# EAGLE board light_controller (EAGLE 9.2.2), part 1 of 2
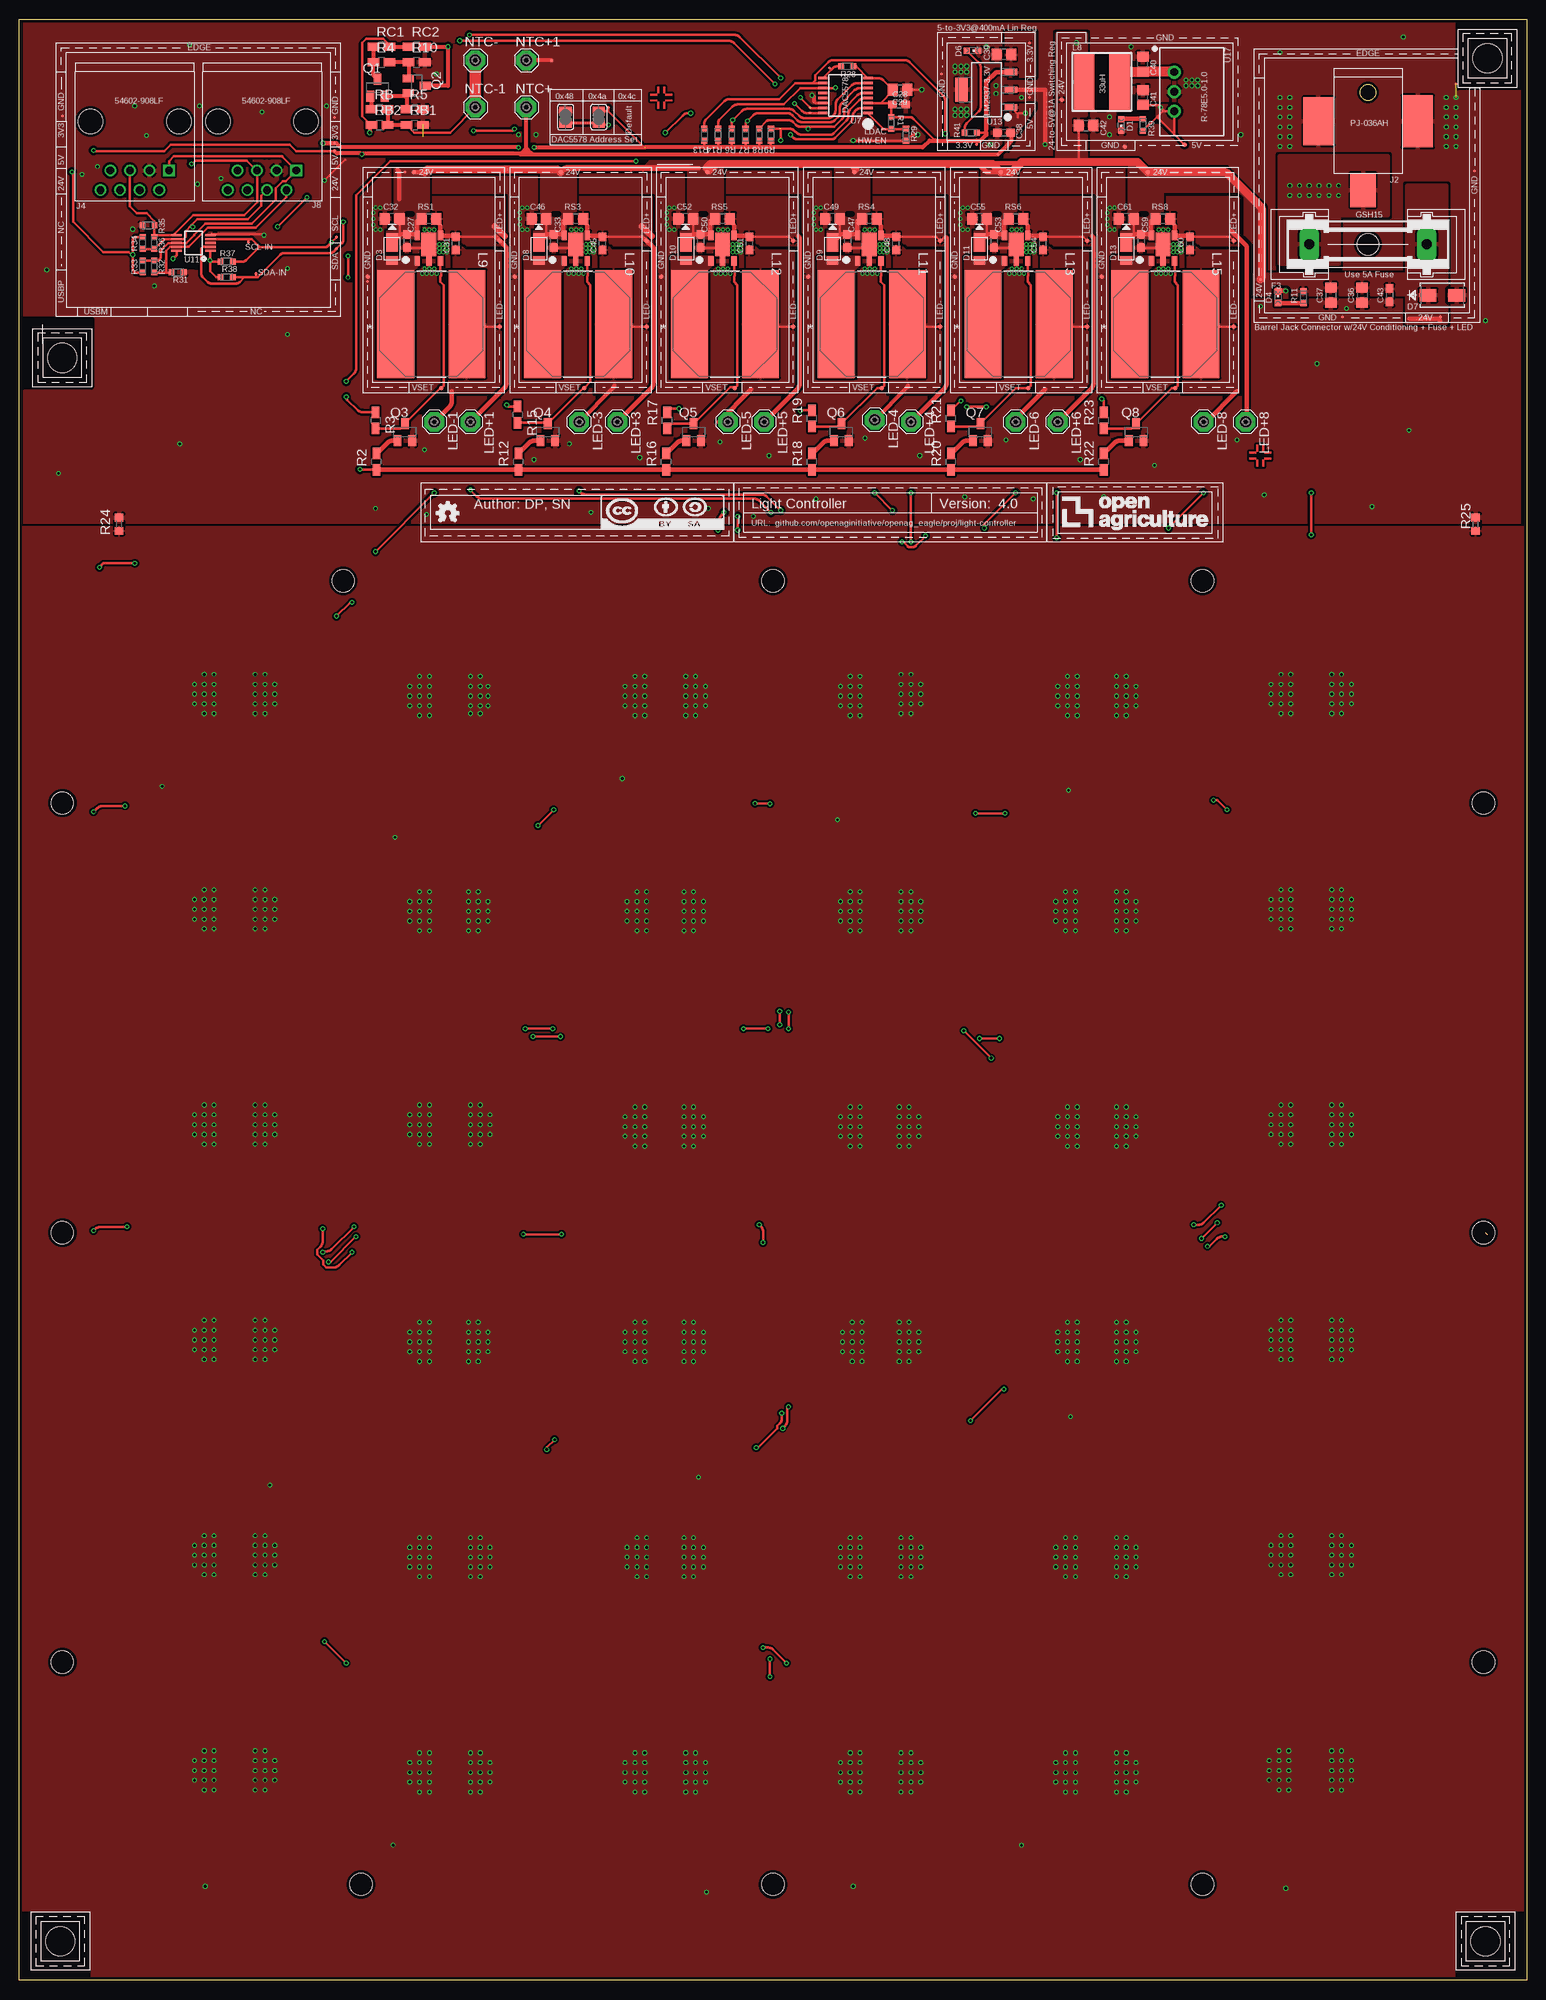
[diagram p2: board, top side]
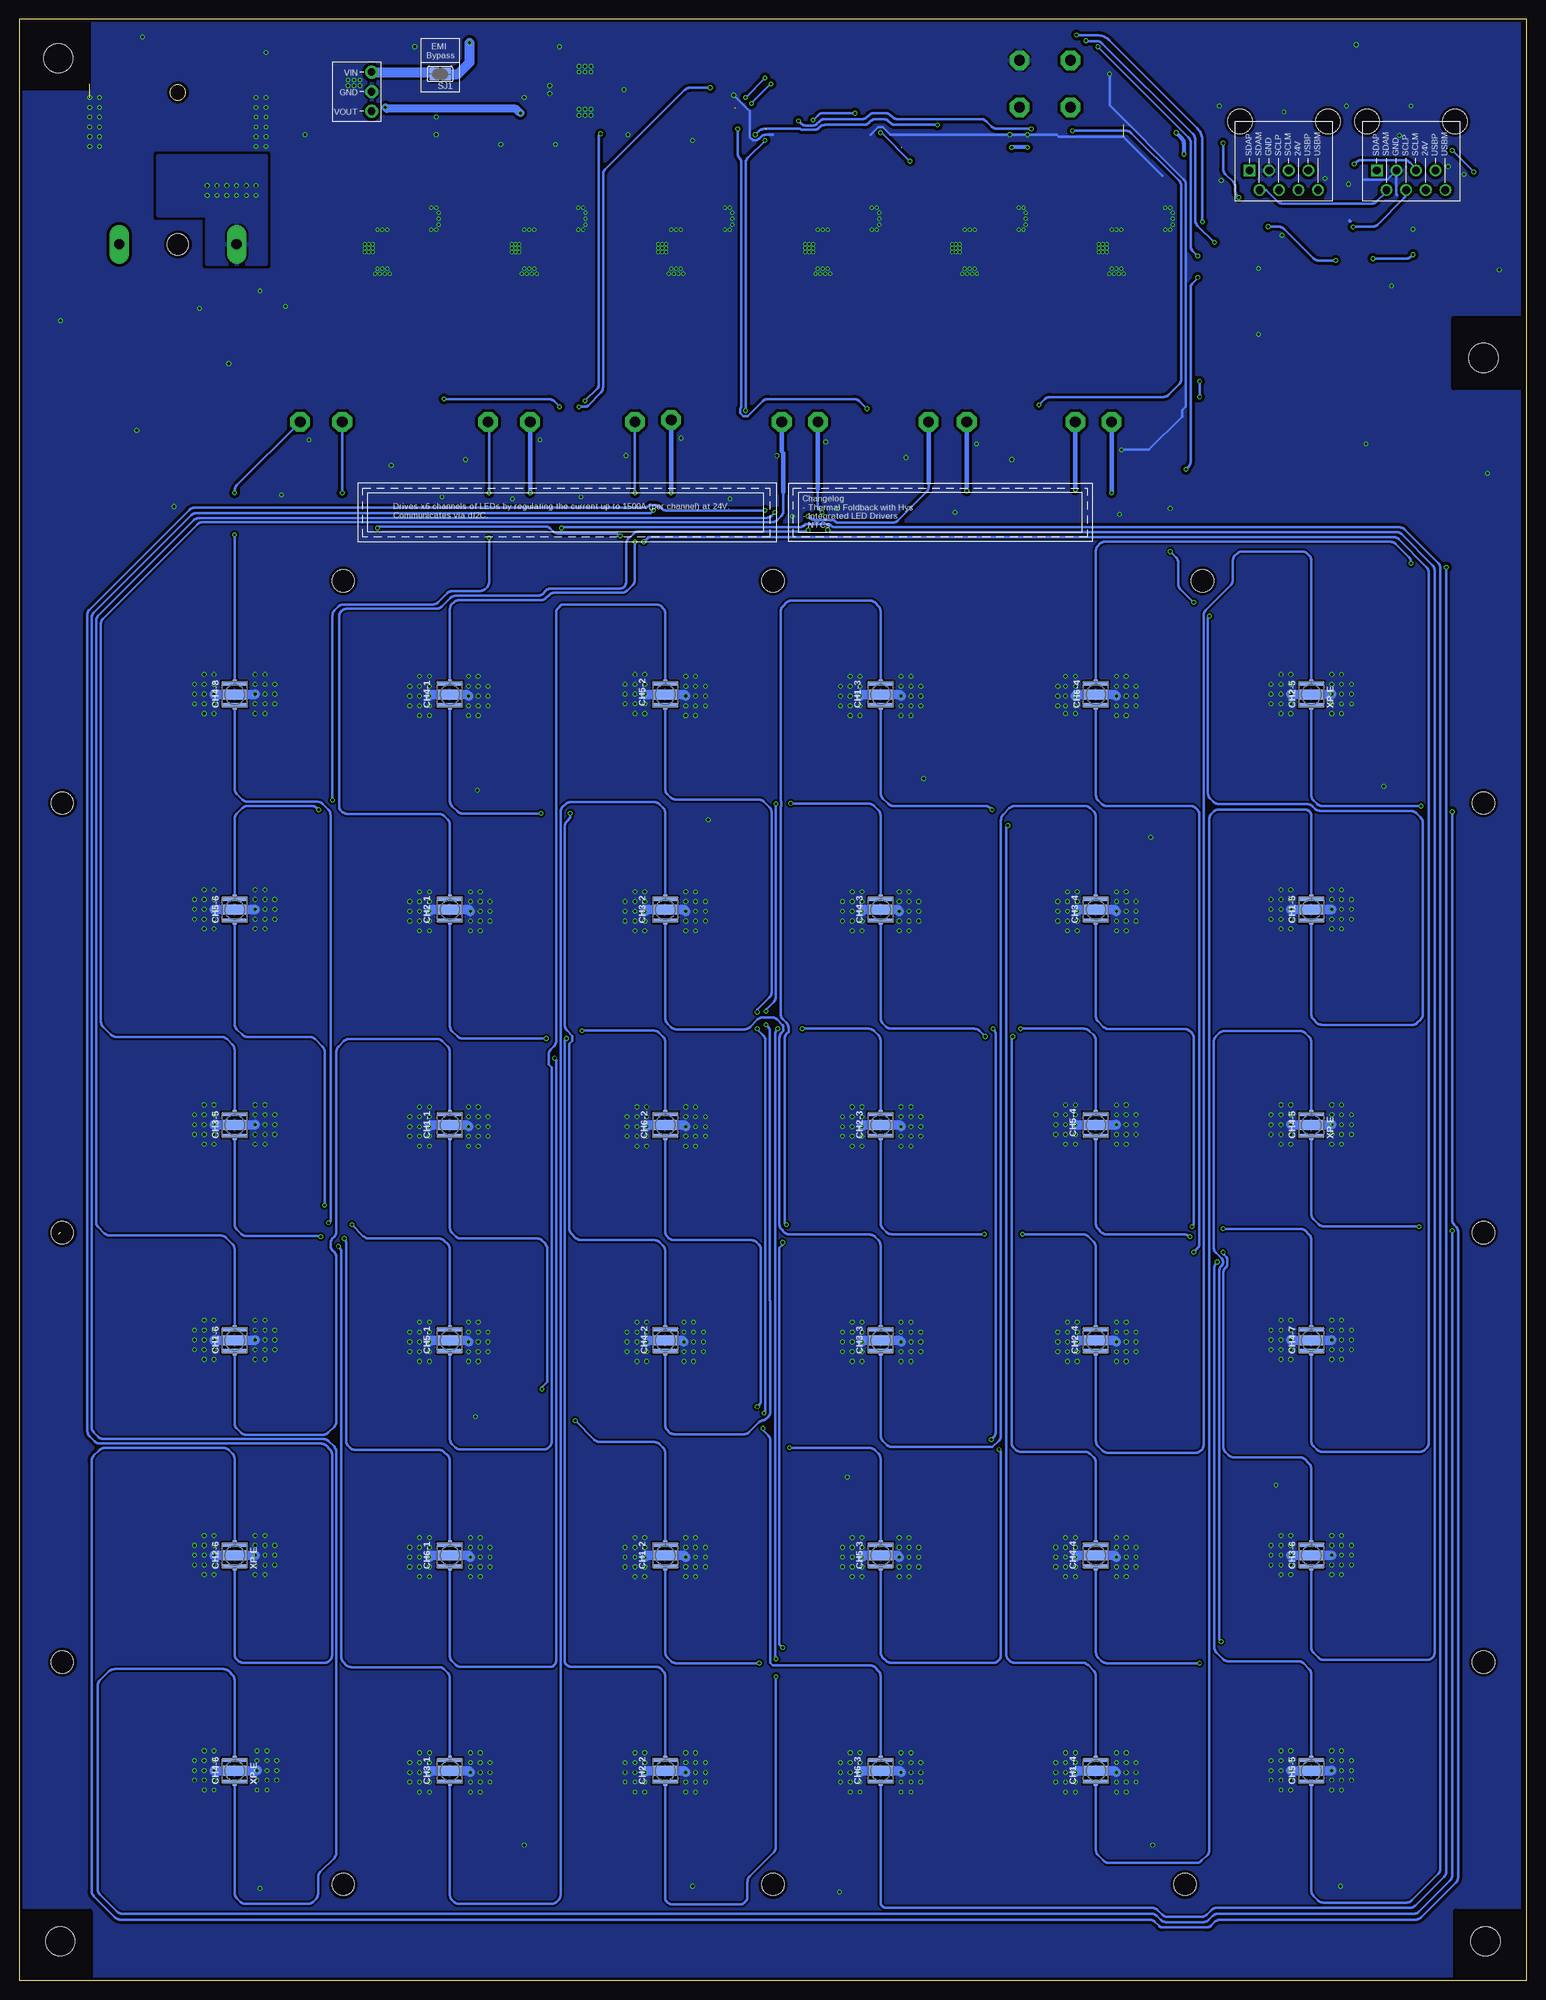
[diagram p3: board, bottom side, seen from below]

Size 195.58 x 254.51 mm. Coordinates in mm from the lower left corner, seen from the top.
Outline: 190.25,97.03 190.5,96.77
Outline: 195.58,0 0,0 0,254.51 195.58,254.51 195.58,0
Copper layers (1*16): Top 0.035559375mm / dielectric 1.6mm / Bottom 0.035559375mm
Design rules "oshpark-2layer-mask": minimum track width 6mil, minimum drill 10mil, track to track 6mil, track to pad 6mil, pad to pad 6mil, via to via 6mil, smd to smd 6mil, copper to edge 15mil, drill to drill 6mil, minimum pad ring 5mil, minimum via ring 5mil, stop-mask expansion 2.5mil, vias tented up to drill 20mil, thermal gap 10mil
Net classes: 0 default: width 0.305 mm, drill 0.254 mm, clearance 0.254 mm
Holes 2.92 mm at 97.79,181.61 42.04,181.61 153.54,181.61 97.79,12.45 44.32,12.45 153.54,12.45 5.59,152.78 5.59,97.03 5.59,41.27 189.99,152.78 189.99,97.03 189.99,41.27
tRestrict: 9 lines

## Footprints (pad centres in the part's own frame; a part is rotated, then mirrored left to right if it is on the bottom)
C0603 = smd 1.1 x 1: 1 -0.85,0; 2 0.85,0
C0805 = smd 1.3 x 1.5: 1 -0.95,0; 2 0.95,0
CREE-XLAMP-XP-E = smd 0.5 x 3.3: A 1.4,0; C -1.4,0 | smd 0.45 x 0.5: A@1 1.725,0; C@1 -1.725,0 | smd 1.3 x 3.3: THERM 0,0
CHIPLED_0603 = smd 0.8 x 0.8: A 0,-0.75; C 0,0.75
POWERDI123 = smd 1.05 x 1.5: + -1.3,0 | smd 2.4 x 1.5: - 1.05,0
SMA = smd 2.18 x 1.63: 1 -1.857,0; 2 1.857,0
GSH15 = drill 1.321 pad 2.54 long: 1 -7.62,0; 2 7.62,0 | hole 2.794: 0,0
BARREL-JACK-PJ-036AH = smd 4.4 x 3.3: 1 2.2,-0.65 | smd 6.75 x 3.9: 2 -6.75,6.45 | smd 6.2 x 3.9: 3 -6.75,-6.45
RJ45-DI2C-USB-54602-908LF = drill 1: 24V(6) 1.905,8.89; DSCLM(5) 0.635,6.35; DSCLP(4) -0.635,8.89; DSDAM(2) -3.175,8.89; GND(3) -1.905,6.35; USBM(8) 4.445,8.89; USBP(7) 3.175,6.35 | drill 1 square: DSDAP(1) -4.445,6.35 | hole 3.2: -5.715,0; 5.715,0
29333C = smd 2.6 x 7.2: 1 -2.3,0; 2 2.3,0
IND_BOURNS_SDR1307 = smd 4.75 x 13.995: 1 -4.623,0; 2 4.623,0
SE14 = drill 1.397 pad 2.54 octagon: MP 0,0
SOT23-BEC = smd 1 x 1.4: B -0.95,-1.1; C 0,1.1; E 0.95,-1.1
RC0603N = smd 0.756 x 0.8: 1 -0.778,0; 2 0.778,0
R0805W = smd 1.5 x 1: 1 -1.052,0; 2 1.052,0
R0603 = smd 1 x 1.1: 1 -0.85,0; 2 0.85,0
R0805 = smd 1.3 x 1.5: 1 -0.95,0; 2 0.95,0
EMI-BYPASS = smd 1.168 x 1.6: 1 -0.762,0.254; 2 0.762,0.254
SJ1 = smd 1.168 x 1.6: 1 -0.762,0; 2 0.762,0
TP04R = smd 0.4 x 0.4: 1 0,0
TP06R = smd 0.6 x 0.6: TP 0,0
TSSOP16 = smd 0.35 x 1.2: 1 -2.275,-2.925; 2 -1.625,-2.925; 3 -0.975,-2.925; 4 -0.325,-2.925; 5 0.325,-2.925; 6 0.975,-2.925; 7 1.625,-2.925; 8 2.275,-2.925; 9 2.275,2.925; 10 1.625,2.925; 11 0.975,2.925; 12 0.325,2.925; 13 -0.325,2.925; 14 -0.975,2.925; 15 -1.625,2.925; 16 -2.275,2.925
SOP50P490X110-10N = smd 1.4 x 0.3: 1 -2.2,1; 2 -2.2,0.5; 3 -2.2,0; 4 -2.2,-0.5; 5 -2.2,-1; 6 2.2,-1; 7 2.2,-0.5; 8 2.2,0; 9 2.2,0.5; 10 2.2,1
MP04A = smd 1.6 x 0.838: 1 -3.2,2.3; 2 -3.2,0; 3 -3.2,-2.3 | smd 1.6 x 3.099: 4 3.2,0
R-78E5.0-1.0 = drill 1 pad 1.676: 1 -2.54,0; 2 0,0; 3 2.54,0
CORNER = hole 3.81: 0,0
AL8861 = smd 0.68 x 1.2: 1 -1.5,-1.65; 2 0,-1.65; 3 1.5,-1.65; 4 1.5,1.65; 5 -1.5,1.65 | smd 1.93 x 3.05: 44 0,0.475

## Placement (x,y rotation side)
C27  0.1uF  [C0603]  50.29,225.74 270 top
C28  0.1uF  [C0603]  114.17,243.46 0 top
C29  4.7uF  [C0805]  114.3,245.36 0 top
C31  0.1uF  [C0603]  56.64,225.42 90 top
C32  10uF  [C0805]  48.39,228.6 180 top
C33  0.1uF  [C0603]  69.34,225.74 270 top
C36  10uF  [C0805]  174.24,218.69 270 top
C37  4.7uF  [C0805]  170.18,218.69 270 top
C38  0.1uF  [C0603]  127.76,239.78 180 top
C39  10uF  [C0805]  127.76,249.94 180 top
C40  10uF  [C0805]  145.8,248.67 90 top
C41  10uF  [C0805]  145.8,244.35 90 top
C42  10uF  [C0805]  138.43,240.73 0 top
C43  0.1uF  [C0603]  177.8,218.69 270 top
C45  0.1uF  [C0603]  75.69,225.42 90 top
C46  10uF  [C0805]  67.44,228.6 180 top
C47  0.1uF  [C0603]  107.44,225.74 270 top
C48  0.1uF  [C0603]  113.79,225.42 90 top
C49  10uF  [C0805]  105.54,228.6 180 top
C50  0.1uF  [C0603]  88.39,225.74 270 top
C51  0.1uF  [C0603]  94.74,225.42 90 top
C52  10uF  [C0805]  86.49,228.6 180 top
C53  0.1uF  [C0603]  126.49,225.74 270 top
C54  0.1uF  [C0603]  132.84,225.42 90 top
C55  10uF  [C0805]  124.59,228.6 180 top
C59  0.1uF  [C0603]  145.54,225.74 270 top
C60  0.1uF  [C0603]  151.89,225.42 90 top
C61  10uF  [C0805]  143.64,228.6 180 top
CH1-1  XP-E  [CREE-XLAMP-XP-E]  139.7,111 90 bottom
CH1-2  XP-E  [CREE-XLAMP-XP-E]  111.76,55.12 90 bottom
CH1-3  XP-E  [CREE-XLAMP-XP-E]  83.82,166.88 90 bottom
CH1-4  XP-E  [CREE-XLAMP-XP-E]  55.88,27.18 90 bottom
CH1-5  XP-E  [CREE-XLAMP-XP-E]  27.94,138.94 90 bottom
CH1-6  XP-E  [CREE-XLAMP-XP-E]  167.64,83.06 90 bottom
CH2-1  XP-E  [CREE-XLAMP-XP-E]  139.7,138.94 90 bottom
CH2-2  XP-E  [CREE-XLAMP-XP-E]  111.76,27.18 90 bottom
CH2-3  XP-E  [CREE-XLAMP-XP-E]  83.82,111 90 bottom
CH2-4  XP-E  [CREE-XLAMP-XP-E]  55.88,83.06 90 bottom
CH2-5  XP-E  [CREE-XLAMP-XP-E]  27.94,166.88 90 bottom
CH2-6  XP-E  [CREE-XLAMP-XP-E]  167.64,55.12 90 bottom
CH3-1  XP-E  [CREE-XLAMP-XP-E]  139.7,27.18 90 bottom
CH3-2  XP-E  [CREE-XLAMP-XP-E]  111.76,138.94 90 bottom
CH3-3  XP-E  [CREE-XLAMP-XP-E]  83.82,83.06 90 bottom
CH3-4  XP-E  [CREE-XLAMP-XP-E]  55.88,138.94 90 bottom
CH3-5  XP-E  [CREE-XLAMP-XP-E]  167.64,111 90 bottom
CH3-6  XP-E  [CREE-XLAMP-XP-E]  27.94,55.12 90 bottom
CH4-1  XP-E  [CREE-XLAMP-XP-E]  139.7,166.88 90 bottom
CH4-2  XP-E  [CREE-XLAMP-XP-E]  111.76,83.06 90 bottom
CH4-3  XP-E  [CREE-XLAMP-XP-E]  83.82,138.94 90 bottom
CH4-4  XP-E  [CREE-XLAMP-XP-E]  55.88,55.12 90 bottom
CH4-5  XP-E  [CREE-XLAMP-XP-E]  27.94,111 90 bottom
CH4-6  XP-E  [CREE-XLAMP-XP-E]  167.64,27.18 90 bottom
CH4-7  XP-E  [CREE-XLAMP-XP-E]  27.94,83.06 90 bottom
CH4-8  XP-E  [CREE-XLAMP-XP-E]  167.64,166.88 90 bottom
CH5-1  XP-E  [CREE-XLAMP-XP-E]  139.7,83.06 90 bottom
CH5-2  XP-E  [CREE-XLAMP-XP-E]  111.76,166.88 90 bottom
CH5-3  XP-E  [CREE-XLAMP-XP-E]  83.82,55.12 90 bottom
CH5-4  XP-E  [CREE-XLAMP-XP-E]  55.88,111 90 bottom
CH5-5  XP-E  [CREE-XLAMP-XP-E]  27.94,27.18 90 bottom
CH5-6  XP-E  [CREE-XLAMP-XP-E]  167.64,138.94 90 bottom
CH6-1  XP-E  [CREE-XLAMP-XP-E]  139.7,55.12 90 bottom
CH6-2  XP-E  [CREE-XLAMP-XP-E]  111.76,111 90 bottom
CH6-3  XP-E  [CREE-XLAMP-XP-E]  83.82,27.18 90 bottom
CH6-4  XP-E  [CREE-XLAMP-XP-E]  55.88,166.88 90 bottom
D1  APT1608  [CHIPLED_0603]  143,240.79 180 top
D3  SBR2A40P1-7  [POWERDI123]  48.39,224.47 90 top
D4  APT1608  [CHIPLED_0603]  163.32,218.44 0 top
D6  APT1608  [CHIPLED_0603]  123.7,250.44 270 top
D7  SMAJ26A  [SMA]  184.66,218.69 0 top
D8  SBR2A40P1-7  [POWERDI123]  67.44,224.47 90 top
D9  SBR2A40P1-7  [POWERDI123]  105.54,224.47 90 top
D10  SBR2A40P1-7  [POWERDI123]  86.49,224.47 90 top
D11  SBR2A40P1-7  [POWERDI123]  124.59,224.47 90 top
D13  SBR2A40P1-7  [POWERDI123]  143.64,224.47 90 top
F1  Use 5A Fuse  [FUSE-CARTRIDGE]  171.96,220.98 0 top
F3  GSH15  [GSH15]  175.01,225.3 0 top
J2  PJ-036AH  [BARREL-JACK-PJ-036AH]  175.01,234.52 270 top
J4  54602-908LF  [RJ45-DI2C-USB-54602-908LF]  14.99,241.22 180 top
J8  54602-908LF  [RJ45-DI2C-USB-54602-908LF]  31.5,241.22 180 top
L8  33uH  [29333C]  140.46,246.38 0 top
L9  100UH  [IND_BOURNS_SDR1307]  53.47,214.95 0 top
L10  100UH  [IND_BOURNS_SDR1307]  72.52,214.95 0 top
L11  100UH  [IND_BOURNS_SDR1307]  110.62,214.95 0 top
L12  100UH  [IND_BOURNS_SDR1307]  91.57,214.95 0 top
L13  100UH  [IND_BOURNS_SDR1307]  129.67,214.95 0 top
L15  100UH  [IND_BOURNS_SDR1307]  148.72,214.95 0 top
LED+1  SE14  [SE14]  58.55,202.25 270 top
LED+3  SE14  [SE14]  77.6,202.25 270 top
LED+4  SE14  [SE14]  115.7,202.25 270 top
LED+5  SE14  [SE14]  96.65,202.25 270 top
LED+6  SE14  [SE14]  134.75,202.25 270 top
LED+8  SE14  [SE14]  159.13,202.25 270 top
LED-1  SE14  [SE14]  53.85,202.25 270 top
LED-3  SE14  [SE14]  72.64,202.25 270 top
LED-4  SE14  [SE14]  111,202.5 270 top
LED-5  SE14  [SE14]  91.95,202.25 270 top
LED-6  SE14  [SE14]  129.29,202.25 270 top
LED-8  SE14  [SE14]  153.67,202.25 270 top
NTC+  SE14  [SE14]  65.79,243.08 0 top
NTC+1  SE14  [SE14]  65.79,249.17 0 top
NTC-  SE14  [SE14]  59.18,249.17 0 top
NTC-1  SE14  [SE14]  59.18,243.08 0 top
Q1  MMBT2222A  [SOT23-BEC]  46.48,245.62 0 top
Q2  MMBT2222A  [SOT23-BEC]  51.56,245.87 270 top
Q3  MMBT2222A  [SOT23-BEC]  50.04,200.91 0 top
Q4  MMBT2222A  [SOT23-BEC]  68.58,200.91 0 top
Q5  MMBT2222A  [SOT23-BEC]  87.5,200.91 0 top
Q6  MMBT2222A  [SOT23-BEC]  106.68,200.91 0 top
Q7  MMBT2222A  [SOT23-BEC]  124.71,200.91 0 top
Q8  MMBT2222A  [SOT23-BEC]  144.91,200.91 0 top
R1  1K  [RC0603N]  113.16,241.05 270 top
R2  [R0805W]  46.35,197.1 90 top
R3  [R0805W]  46.23,202.44 270 top
R4  [R0805W]  46.99,248.92 0 top
R5  [R0805W]  51.31,242.82 0 top
R6  1K  [RC0603N]  92.46,239.52 270 top
R7  1K  [RC0603N]  94.23,239.52 270 top
R8  1K  [RC0603N]  96.01,239.52 270 top
R9  1K  [RC0603N]  97.54,239.52 270 top
R10  [R0805W]  51.56,248.92 0 top
R11  1K  [RC0603N]  166.62,218.44 90 top
R12  [R0805W]  64.77,197.1 90 top
R13  1K  [RC0603N]  88.9,239.52 270 top
R14  1K  [RC0603N]  90.68,239.52 270 top
R15  [R0805W]  64.64,203.2 270 top
R16  [R0805W]  83.95,197.1 90 top
R17  [R0805W]  84.07,202.44 90 top
R18  [R0805W]  102.87,197.1 90 top
R19  [R0805W]  102.87,202.69 90 top
R20  [R0805W]  120.9,197.1 90 top
R21  [R0805W]  120.9,202.69 90 top
R22  [R0805W]  140.72,197.1 90 top
R23  [R0805W]  140.72,202.44 90 top
R24  [R0603]  12.95,188.98 90 top
R25  [R0603]  188.98,188.98 90 top
R28  1K  [RC0603N]  107.44,248.41 180 top
R29  0 OHM  [RC0603N]  115.06,239.52 90 top
R31  600  [RC0603N]  20.57,221.67 0 top
R32  120  [RC0603N]  17.53,222.43 270 top
R33  600  [RC0603N]  16,222.43 90 top
R34  600  [RC0603N]  16,225.48 90 top
R35  600  [RC0603N]  16.76,227.76 0 top
R36  120  [RC0603N]  17.53,225.48 270 top
R37  2.2k  [RC0603N]  26.92,223.06 180 top
R38  2.2k  [RC0603N]  26.92,221.03 180 top
R39  100  [RC0603N]  145.8,240.79 270 top
R41  100  [RC0603N]  123.44,239.78 0 top
RB  [R0805W]  46.74,242.82 0 top
RB1  [R0805W]  51.31,240.79 0 top
RB2  [R0805W]  46.74,240.79 0 top
RC1  [R0805W]  46.99,250.95 0 top
RC2  [R0805W]  51.56,250.95 0 top
RS1  6.34 ohm  [R0805]  53.15,228.6 180 top
RS3  6.34 ohm  [R0805]  72.2,228.6 180 top
RS4  6.34 ohm  [R0805]  110.3,228.6 180 top
RS5  6.34 ohm  [R0805]  91.25,228.6 180 top
RS6  6.34 ohm  [R0805]  129.35,228.6 180 top
RS8  6.34 ohm  [R0805]  148.4,228.6 180 top
SJ1  [EMI-BYPASS]  140.97,247.65 180 bottom
SJ_A16  [SJ1]  75.18,241.81 270 top
SJ_A17  [SJ1]  70.87,241.81 270 top
TP1  TPTP04R  [TP04R]  184.4,215.9 0 top
TP2  TPTP04R  [TP04R]  171.7,215.9 0 top
TP10  TPTP06R  [TP06R]  62.36,214.63 180 top
TP11  TPTP06R  [TP06R]  51.18,234.63 180 top
TP12  TPTP04R  [TP04R]  50.04,234.7 270 top
TP13  TPTP04R  [TP04R]  76.45,243.08 270 top
TP14  TPTP04R  [TP04R]  69.09,249.17 90 top
TP15  TPTP04R  [TP04R]  102.62,243.08 270 top
TP16  TPTP04R  [TP04R]  102.62,242.32 270 top
TP17  TPTP04R  [TP04R]  112.01,240.28 270 top
TP18  TPTP06R  [TP06R]  45.21,221.11 180 top
TP19  TPTP06R  [TP06R]  62.36,225.74 270 top
TP20  TPTP06R  [TP06R]  54.74,206.63 270 top
TP21  TPTP06R  [TP06R]  81.41,214.63 180 top
TP22  TPTP06R  [TP06R]  70.23,234.63 180 top
TP23  TPTP06R  [TP06R]  64.26,221.11 180 top
TP24  TPTP06R  [TP06R]  81.41,225.74 270 top
TP25  TPTP06R  [TP06R]  73.28,206.63 270 top
TP26  TPTP06R  [TP06R]  119.51,214.63 180 top
TP27  TPTP06R  [TP06R]  108.33,234.63 180 top
TP28  TPTP06R  [TP06R]  102.36,221.11 180 top
TP29  TPTP06R  [TP06R]  119.51,225.74 270 top
TP30  TPTP06R  [TP06R]  111.89,206.63 270 top
TP31  TPTP06R  [TP06R]  100.46,214.63 180 top
TP32  TPTP04R  [TP04R]  105.16,248.16 270 top
TP33  TPTP04R  [TP04R]  45.21,220.47 180 top
TP34  TPTP04R  [TP04R]  186.44,246.13 0 top
TP35  TPTP04R  [TP04R]  188.85,234.82 0 top
TP36  TPTP04R  [TP04R]  161.04,220.73 0 top
TP37  TPTP06R  [TP06R]  89.28,234.63 180 top
TP38  TPTP06R  [TP06R]  83.31,221.11 180 top
TP39  TPTP06R  [TP06R]  100.46,225.74 270 top
TP42  TPTP04R  [TP04R]  5.59,241.99 270 top
TP44  TPTP04R  [TP04R]  29.72,225.55 270 top
TP45  TPTP04R  [TP04R]  30.73,221.49 270 top
TP48  TPTP04R  [TP04R]  40.89,238.43 270 top
TP49  TPTP04R  [TP04R]  40.89,237.41 270 top
TP51  TPTP04R  [TP04R]  40.89,241.73 270 top
TP52  TPTP04R  [TP04R]  41.15,224.71 270 top
TP53  TPTP04R  [TP04R]  41.15,226.24 270 top
TP54  TPTP06R  [TP06R]  151.19,238.25 270 top
TP55  TPTP06R  [TP06R]  135.25,244.09 270 top
TP56  TPTP06R  [TP06R]  143.45,238 270 top
TP57  TPTP04R  [TP04R]  124.21,238.25 90 top
TP58  TPTP04R  [TP04R]  127,236.98 90 top
TP59  TPTP04R  [TP04R]  119.63,247.4 90 top
TP60  TPTP04R  [TP04R]  131.06,251.46 90 top
TP61  TPTP04R  [TP04R]  131.06,244.35 90 top
TP62  TPTP06R  [TP06R]  92.84,206.63 270 top
TP63  TPTP06R  [TP06R]  138.56,214.63 180 top
TP64  TPTP06R  [TP06R]  127.38,234.63 180 top
TP65  TPTP06R  [TP06R]  121.41,221.11 180 top
TP73  TPTP06R  [TP06R]  138.56,225.74 270 top
TP74  TPTP06R  [TP06R]  130.94,206.63 270 top
TP80  TPTP06R  [TP06R]  157.61,214.63 180 top
TP81  TPTP06R  [TP06R]  146.43,234.63 180 top
TP82  TPTP06R  [TP06R]  140.46,221.11 180 top
TP83  TPTP06R  [TP06R]  157.61,225.74 270 top
TP84  TPTP06R  [TP06R]  149.99,206.63 270 top
U7  DAC5578  [TSSOP16]  107.19,244.6 90 top
U11  PCA9615  [SOP50P490X110-10N]  22.61,225.48 180 top
U13  LM2937-3.3V  [MP04A]  125.48,245.36 180 top
U17  R-78E5.0-1.0  [R-78E5.0-1.0]  149.86,245.11 270 top
U$1  [CORNER]  5.33,5.08 0 top
U$2  [CORNER]  190.25,5.08 90 top
U$3  [CORNER]  5.59,210.57 270 top
U$4  [CORNER]  190.5,249.43 180 top
U$6  AUTHOR  [AUTHOR]  52.07,186.69 0 top
U$7  TITLE  [TITLE]  92.71,186.69 0 top
U$8  [LOGO]  133.35,186.69 0 top
U$10  [PASSER]  83.31,244.35 0 top
U$11  AL8861  [AL8861]  53.15,224.79 0 top
U$12  AL8861  [AL8861]  72.2,224.79 0 top
U$13  AL8861  [AL8861]  110.3,224.79 0 top
U$14  AL8861  [AL8861]  91.25,224.79 0 top
U$15  AL8861  [AL8861]  129.35,224.79 0 top
U$16  [PASSER]  161.04,197.87 0 top
U$17  AL8861  [AL8861]  148.4,224.79 0 top

## Tracks (layer width: path | path; a pad name or v marks a point on that pad's centre or on a via)
24V_EMI
  Top 1.27: U17.1 149.79,247.72 C40.1 144.1,247.72 arc90 L8.2
  Bottom 1.27: U17.1 141.99,247.65 SJ1.2
24V_IN  (via drill 0.35)
  other vias: 171.2,232.92 171.2,231.65 169.93,232.92 169.93,231.65 168.66,232.92 168.66,231.65 167.39,232.92 166.12,232.92 166.12,231.65 167.39,231.65 164.85,231.65 164.85,232.92
  pour Bottom (isolate 0.406): 171.2,222.76 163.58,222.76 163.58,236.73 177.55,236.73 177.55,229.11 171.2,229.11
  pour Top (isolate 0.406): 163.58,222.76 171.2,222.76 171.2,229.11 177.55,229.11 177.55,236.73 163.58,236.73
!LDAC!
  Top 0.305: U7.1 112.17,240.27 | 112.17,240.27 R1.2 115.02,240.27 R29.2 | TP17.1 112.03,240.27 112.17,240.27
+3V3  (via drill 0.35)  (1 unrouted)
  Top 0.305: v24.77,223.19 24.89,223.06 R37.2 | v24.77,223.19 24.77,221.79 25.53,221.03 R38.2 | U11.1 24.81,223.23 v24.77,223.19 | U7.3 111.76,243.63 | 111.76,243.63 113.03,243.63 | 113.03,243.63 113.16,243.63 C28.1 | 111.76,243.63 113.35,245.22 C29.1 112.13,246.58 arc45 111.42,246.88 U7.8 108.58,248.41 R28.1 | 113.03,243.63 113.16,243.5 R1.1 115.43,241.82 arc-45 116.08,241.55 118.87,238.76 | 76.45,242.57 TP13.1 | TP57.1 124.21,238.76 | R41.2 125.48,239.78 | 88.9,238.51 R13.2 88.9,237.87 | SJ_A16.1 76.45,242.57 | 76.45,242.57 81.17,237.85 | R14.2 90.68,237.87 | R6.2 92.46,237.87 | R7.2 94.23,237.87 | R8.2 96.01,237.87 | R9.2 97.54,237.87 | v33.53,227.58 v37.34,231.39
  Top 0.508: 125.48,240.28 125.48,239.78 125.48,239.52 124.71,238.76 124.21,238.76 118.87,238.76 118.11,238.76 117.22,237.87 97.54,237.87 96.01,237.87 94.23,237.87 92.46,237.87 90.68,237.87 88.9,237.87 81.15,237.87 | v64.77,237.87 64.72,237.92 41.66,237.92 41.15,238.43 TP48.1 | 81.17,237.85 66.82,237.85 v66.8,237.87
  Top 0.559: 125.48,240.28 125.48,246.38 126.76,247.66 U13.3 | TP48.1 v39.37,238.43 | R41.2 124.21,239.76
  Bottom 0.305: 33.66,227.58 v33.53,227.58 32.17,227.58 arc45 31.45,227.29 27.65,223.49 arc-45 26.93,223.19 v24.77,223.19 | v39.37,238.43 39.37,235.11 arc-45 39.07,234.39 38.08,233.4 arc45 37.78,232.69 37.78,232.26 arc-45 37.49,231.54 v37.34,231.39
  Bottom 0.508: v64.77,237.87 v66.8,237.87
  pour Top (isolate 0.305): 131.83,252.73 128.02,252.73 128.02,247.14 131.83,247.14
+5V  (via drill 0.35)
  Top 0.305: v19.94,223.44 20.41,223.91 U11.10 | R34.2 15,226.25 14.73,225.98 v14.73,223.95 14.73,223.77 | R33.1 15,221.65 14.73,221.92 14.73,223.77 | U13.1 129.54,242.2 | 129.54,242.2 129.54,241.81 | 45.81,241.02 RB2.1 45.64,240.79 45.55,240.88 44.53,241.9 44.53,251.46 45.03,251.97 47.24,251.97 48.01,251.21 48.01,250.99 RC1.2 | 14.73,223.77 14.22,224.28 10.92,224.28 6.98,228.22 | R39.2 147.71,241.93 | 147.71,241.93 148.35,242.57 148.59,242.57 | 148.59,242.57 U17.3 149.86,239.59 | 148.59,242.57 v148.08,243.08 147.83,243.33 145.86,243.33 C41.1 | 149.86,239.59 TP54.TP | 149.86,239.59 147.71,241.74 147.71,241.93 | 129.54,242.2 129.66,242.32 v130.56,242.32 | 6.98,228.22 | TP49.1 35.91,237.41 35.07,238.25 19.63,238.25 18.8,237.41 9.73,237.41 v9.65,237.49 | v6.86,234.7 6.98,234.57 6.98,228.22
  Top 0.508: RC1.2 RC2.1 | TP49.1 41.2,237.11 44.32,237.11 v44.45,236.98 44.53,237.06 65.1,237.06 | C38.1 128.78,239.61 128.78,238.76 TP58.1 66.55,236.98 | 65.79,236.98 65.02,236.98 65.1,237.06 | 65.79,236.98 66.55,236.98 | v45.47,239.78 45.55,239.86 45.55,240.88 | 65.79,236.98 65.79,237.74 | 65.79,237.74 NTC+.MP | 65.1,237.06 65.11,237.06 65.58,237.53 65.58,237.54 65.79,237.74 | 65.79,237.74 65.99,237.54 65.99,237.53 66.47,237.06 66.55,236.98
  Bottom 0.305: v6.86,234.7 v9.65,237.49 | v14.73,223.95 14.94,223.74 arc45 15.66,223.44 v19.94,223.44
  Bottom 0.508: v44.45,236.98 44.45,238.34 arc-45 44.75,239.06 v45.47,239.78
  Bottom 1.016: v148.08,243.08 147.88,242.87 131.13,242.87 130.57,242.32 v130.56,242.32
  pour Top (isolate 0.305): 131.83,243.33 128.02,243.33 128.02,237.49
  pour Top: 147.57,243.33 147.57,241.81 149.86,239.52 149.86,242.57 149.1,243.33
+24V  (via drill 0.35)
  Top 0.305: TP1.1 184.4,215.39 | C32.1 49.34,226.71 49.46,226.59 | C46.1 68.39,226.71 68.51,226.59 | C52.1 87.44,226.71 87.56,226.59 | C49.1 106.49,226.71 106.61,226.59 | C55.1 125.54,226.71 125.66,226.59 | C61.1 144.59,226.71 144.71,226.59 | C42.1 137.48,236.15 137.67,235.97
  Top 0.559: 180.34,215.65 184.15,215.65 184.4,215.39 | TP64.TP 125.54,234.63 124.46,235.71 108.71,235.71 108.71,235.01 TP27.TP 108.33,235.08 107.7,235.71 104.65,235.71 90.68,235.71 89.6,234.63 TP37.TP 89.28,235.08 89.15,235.2 | 88.14,235.2 86.87,235.2 | 52.58,234.63 TP11.TP
  Top 0.61: RS1.2 51.56,228.28 51.56,226.38 51.35,226.59 C27.1 49.46,226.59 D3.- | RS3.2 70.61,228.28 70.61,226.38 70.4,226.59 C33.1 68.51,226.59 D8.- | RS5.2 89.66,228.28 89.66,226.38 89.45,226.59 C50.1 87.56,226.59 D10.- | RS4.2 108.71,228.28 108.71,226.38 108.5,226.59 C47.1 106.61,226.59 D9.- | RS6.2 127.76,228.28 127.76,226.38 127.55,226.59 C53.1 125.66,226.59 D11.- | RS8.2 146.81,228.28 146.81,226.38 146.6,226.59 C59.1 144.71,226.59 D13.- | 125.73,235.71 125.86,235.84 129.92,235.84 130.05,235.97 | 49.02,234.95 49.28,234.7 49.28,231.14
  Top 0.762: 86.87,235.2 80.95,235.2 80.91,235.16 79.37,235.16 | 79.37,235.16 79.32,235.2 | 79.37,235.16 71.02,235.16 arc45 70.57,234.97 TP22.TP
  Top 1.016: 89.15,235.2 89.66,235.71 104.65,235.71 125.73,235.71 126.3,235.71 TP64.TP 128.71,234.63 130.05,235.97 137.67,235.97 145.1,235.97 TP81.TP 156.59,234.63 161.19,230.03 161.19,220.88 TP36.1 | TP22.TP 69.85,235.01 52.96,235.01 52.58,234.63
  Bottom 1.27: SJ1.1 138.68,247.4 137.16,248.92 v137.16,251.46
  pour Top (isolate 0.406): 138.43,236.22 134.62,236.22 134.62,252.73 138.43,252.73
  pour Top (isolate 0.406): 185.17,215.14 185.17,232.92 180.09,232.92 180.09,215.14
  pour Top (isolate 0.406): 180.59,221.49 180.59,218.69 160.27,218.69 160.27,221.49
  pour Top (isolate 0.305, no thermals): 49.02,224.47 47.75,224.47 47.75,227.01 48.7,227.01 48.7,235.27 53.15,235.27 53.15,229.55 52.51,229.55 52.51,227.96 51.88,227.96 51.88,226.06 49.02,226.06
  pour Top (isolate 0.305, no thermals): 68.07,224.47 66.8,224.47 66.8,227.01 67.75,227.01 67.75,235.27 72.2,235.27 72.2,229.55 71.56,229.55 71.56,227.96 70.93,227.96 70.93,226.06 68.07,226.06
  pour Top (isolate 0.305, no thermals): 87.12,224.47 85.85,224.47 85.85,227.01 86.8,227.01 86.8,235.27 91.25,235.27 91.25,229.55 90.61,229.55 90.61,227.96 89.98,227.96 89.98,226.06 87.12,226.06
  pour Top (isolate 0.305, no thermals): 106.17,224.47 104.9,224.47 104.9,227.01 105.85,227.01 105.85,235.27 110.3,235.27 110.3,229.55 109.66,229.55 109.66,227.96 109.03,227.96 109.03,226.06 106.17,226.06
  pour Top (isolate 0.305, no thermals): 125.22,224.47 123.95,224.47 123.95,227.01 124.9,227.01 124.9,235.27 129.35,235.27 129.35,229.55 128.71,229.55 128.71,227.96 128.08,227.96 128.08,226.06 125.22,226.06
  pour Top (isolate 0.305, no thermals): 144.27,224.47 143,224.47 143,227.01 143.95,227.01 143.95,235.27 148.4,235.27 148.4,229.55 147.76,229.55 147.76,227.96 147.13,227.96 147.13,226.06 144.27,226.06
  pour Top: 90.04,236.09 81.79,236.09 81.03,235.33 89.28,235.33 89.92,235.97
  pour Top: 147.83,234.7 156.46,234.7 161.29,229.87 161.29,220.73 160.27,220.73 160.27,225.3 159,226.57 159,231.39 158.24,232.16 148.34,232.16 147.83,232.66
  pour Top: 144.02,235.2 144.02,235.71 145.54,235.71 146.05,235.2 156.46,235.2 157.23,234.44 155.7,232.92 151.64,232.92 144.02,232.92
ADDR0  (via drill 0.35)
  Top 0.305: v100.08,239.52 100.46,239.14 arc45 100.95,238.94 105.41,238.94 arc45 105.91,239.14 107.88,241.12 arc45 108.15,241.78 108.15,241.92 arc-45 108.43,242.59 108.52,242.68 arc-45 109.24,242.98 U7.2 | v76.45,240.79 75.44,240.79 SJ_A16.2
  Top 0.406: SJ_A16.2 SJ_A17.2
  Bottom 0.305: v76.45,240.79 81.88,240.79 arc45 82.59,241.09 82.8,241.3 arc-45 83.42,241.55 84.41,241.55 arc-45 85.13,241.26 85.34,241.05 arc45 85.96,240.79 91.06,240.79 arc-45 91.69,240.53 91.81,240.4 arc45 92.4,240.16 94.14,240.16 94.26,240.28 98.89,240.28 arc-45 99.61,239.99 v100.08,239.52
DAC_!CLR!
  Top 0.305: U7.9 105.35,247.96 | TP32.1 105.35,247.96 | R28.2 106.22,248.41 arc45 105.5,248.11 105.35,247.96
DIM1  (via drill 0.35)
  Top 0.305: R6.1 92.46,241.3 v92.58,241.43 93.73,242.58 arc-45 94.45,242.88 99.86,242.88 arc-45 100.58,242.58 101.17,241.98 arc45 101.89,241.68 104.92,241.68 arc45 105.54,241.94 105.62,242.02 arc45 105.92,242.74 105.92,243.42 arc-45 106.22,244.14 108.01,245.93 arc-45 108.73,246.23 U7.7 | v80.01,236.09 48.13,236.09 43.71,231.67 43.71,209.23 arc-45 43.42,208.52 v42.42,207.52 | R3.1 44.61,203.49 arc-45 43.89,203.79 42.58,205.1 arc-45 v42.42,205.49 | v83.82,239.78 86.06,242.02 arc-45 86.78,242.32 v87.12,242.32
  Bottom 0.305: v83.82,239.78 83.69,239.78 v80.01,236.09 | v42.42,205.49 v42.42,207.52 | v87.12,242.32 91.27,242.32 arc-45 91.99,242.02 v92.58,241.43
DIM2  (via drill 0.35)
  Top 0.305: R7.1 94.23,241.05 v94.49,241.3 95.25,242.06 arc-45 95.86,242.32 99.63,242.32 arc-45 100.34,242.02 100.94,241.42 arc45 101.66,241.12 105.1,241.12 arc45 105.81,241.41 106.19,241.79 arc45 106.48,242.5 106.48,242.96 arc-45 106.77,243.68 108.37,245.28 arc-45 109.09,245.58 U7.6 | R15.1 63.46,204.25 v63.25,204.47 | v64.26,240.28 64.01,240.03 v58.93,240.03
  Bottom 0.305: v58.93,240.03 58.67,240.03 58.66,240.04 51.99,240.04 arc45 51.28,239.74 45.08,233.55 arc45 44.78,232.83 44.78,207.86 arc45 45.08,207.14 46.44,205.78 arc45 47.16,205.49 61.81,205.49 arc-45 62.53,205.19 v63.25,204.47 | v64.26,240.28 68.69,240.28 arc45 69.41,240.58 70.08,241.24 arc-45 70.79,241.54 81.61,241.54 arc45 82.33,241.84 82.51,242.02 arc-45 83.22,242.32 84.66,242.32 arc-45 85.37,242.02 85.59,241.8 arc45 86.22,241.54 91.05,241.54 arc-45 91.77,241.24 92.08,240.93 arc45 92.58,240.72 93.49,240.72 arc45 94.2,241.02 v94.49,241.3
DIM3  (via drill 0.35)
  Top 0.305: 102.62,240.56 105.75,240.56 106.74,241.55 arc45 107.04,242.27 107.04,242.93 108.74,244.63 arc-45 109.46,244.93 U7.5 | 102.62,240.56 101.35,240.56 arc-45 100.77,240.8 100.44,241.13 arc45 99.73,241.43 97.31,241.43 arc45 97.02,241.31 R8.1 | R17.2 83.97,203.6 84.33,203.96 v85.6,203.96 | 102.62,240.56 102.36,240.31 v102.36,240.28
  Bottom 0.305: v102.36,240.28 102.36,237.09 arc-45 102.11,236.47 arc45 101.91,235.98 101.91,204.15 102.05,204 102.05,203.41 101.64,203 101.05,203 99.12,204.93 arc45 98.4,205.23 87.29,205.23 arc45 86.57,204.93 v85.6,203.96
DIM4  (via drill 0.35)  (1 unrouted)
  Top 0.305: R19.2 101.38,203.74 v101.35,203.71 | v98.81,238.76 98.81,240.3 99.94,240.3 arc-45 100.65,240 100.86,239.79 arc45 101.58,239.5 105.16,239.5 arc45 105.69,239.72 107.3,241.32 arc45 107.59,242.04 107.59,242.32 arc-45 107.77,242.75 109,243.98 arc-45 109.72,244.28 U7.4 | 98.68,240.3 R9.1
  Bottom 0.305: v98.81,238.76 101.05,236.52 arc-45 101.35,235.8 v101.35,203.71
DIM5  (via drill 0.35)
  Top 0.305: U7.10 102.87,246.23 | 102.87,246.23 100.69,246.23 98.6,244.14 92.17,244.14 arc45 91.45,243.85 89.08,241.48 arc45 88.9,241.05 R13.1 | R21.2 122.14,204.98 v122.17,204.98 | 102.87,246.23 103.26,246.61 103.26,247.14 arc-45 103.31,247.28 104.97,248.93 arc-45 105.66,249.22 114.85,249.22 arc-45 115.57,248.92 119.84,244.65 arc-45 120.14,243.93 v120.14,239.65
  Bottom 0.305: v120.14,239.65 120.4,239.39 120.4,207.01 arc45 120.58,206.58 v122.17,204.98
DIM6  (via drill 0.35)
  Top 0.305: R14.1 90.68,241.05 arc-45 90.86,241.48 92.54,243.16 arc-45 93.26,243.46 99.19,243.46 101.31,245.58 U7.11 105.88,245.58 v105.92,245.62 | R23.2 140.72,204.98 v140.46,205.23 | v122.94,204.22 v125.48,204.22
  Bottom 0.305: v122.94,204.22 122.17,204.22 arc-45 121.76,204.39 120.13,206.01 arc-45 119.84,206.73 119.84,234.33 arc45 119.54,235.04 109.26,245.32 arc45 108.54,245.62 v105.92,245.62 | v140.46,205.23 126.91,205.23 arc45 126.19,204.93 v125.48,204.22
DSCLM_1  (via drill 0.35)
  Top 0.305: U11.6 17.68,226.48 17.56,226.35 R36.1 17.53,227.75 R35.2 17.54,228.33 16.51,229.36 15.24,229.36 14.35,230.25 J4.DSCLM(5) | 20.07,226.57 22.61,229.11 29.21,229.11 30.86,230.76 J8.DSCLM(5) 30.81,234.87 29.52,236.17 22.81,236.17 v22.35,235.71
  Bottom 0.305: J4.DSCLM(5) 14.35,235.14 15.08,235.87 15.13,235.92 arc-45 15.85,236.22 21.42,236.22 arc-45 22.14,235.92 v22.35,235.71
DSCLP_1  (via drill 0.35)
  Top 0.305: R34.1 R36.2 18.8,225.98 U11.7 21.25,225.98 21.59,226.31 21.59,227.02 22.31,227.75 | J8.DSCLP(4) 31.42,231.62 31.42,230.3 29.67,228.55 23.11,228.55 22.31,227.75 | v22.5,227.56 22.31,227.75
  Bottom 0.305: v22.5,227.56 20.05,227.56 arc-45 19.33,227.86 15.92,231.27 arc-45 15.62,231.99 J4.DSCLP(4)
DSDAM_1
  Top 0.305: R32.2 19.05,221.65 | 19.05,221.65 19.53,221.65 R31.1 | 19.05,221.65 19.05,224.46 19.57,224.98 U11.9 22.01,224.98 24.46,227.43 30.67,227.43 34.67,231.44 J8.DSDAM(2)
  Bottom 0.305: J4.DSDAM(2) 18.16,232.12 19.41,230.87 arc45 20.13,230.58 31.61,230.58 arc45 32.29,230.86 33.77,232.33 J8.DSDAM(2)
DSDAP_1
  Top 0.305: R33.2 R32.1 18.05,223.21 18.38,223.54 18.38,224.55 19.3,225.48 U11.8 21.67,225.48 22.7,226.51 22.7,226.56 24.13,227.99 30.18,227.99 33.29,231.1 33.29,232.59 34.19,233.49 34.56,233.49 J8.DSDAP(1) 34.12,236.69 arc45 34.04,236.73 32.45,236.73 32.42,236.7 31.84,236.7 31.81,236.73 20.07,236.73 19.43,236.09 J4.DSDAP(1)
GND  (via drill 0.25, 0.35)  (2 unrouted)
  Top 0.305: U7.14 103.34,243.63 103.12,243.84 | C29.2 v117.09,245.36 | v116.59,239.52 115.84,239.52 R29.1 115.05,238.76 v108.2,238.76 107.95,238.76 | U11.5 24.95,226.62 31.62,226.62 v31.75,226.49 | v39.62,233.6 42.31,236.29
  Top 0.406: C27.2 52.78,224.89 U$11.44 53.15,223.2 | C33.2 71.83,224.89 U$12.44 72.2,223.2 | C50.2 90.88,224.89 U$14.44 91.25,223.2 | C47.2 109.93,224.89 U$13.44 110.3,223.2 | C53.2 128.98,224.89 U$15.44 129.35,223.2 | C59.2 148.03,224.89 U$17.44 148.4,223.2
  Top 0.508: v102.87,244.65 103.12,244.4 103.12,243.84 | TP14.1 NTC+1.MP
  Top 0.559: D4.C 163.38,219.25 v164.34,219.25
  Top 0.61: U13.2 133.1,245.36 v133.1,238.25
  Bottom 0.305: v102.87,244.65 100.78,242.57 100.78,239.23 100.37,238.81 100.08,238.81 arc-45 99.58,239.02 99.37,239.22 arc45 98.65,239.52 97.79,239.52 | 85.08,239.52 84.11,240.48 83.53,240.48 82.56,239.52 v67.06,239.52 v64.77,239.52 60.96,239.52 60.71,239.27 52.32,239.27 47.24,234.19 | v54.1,247.4 54.1,243.36 44.52,233.78 arc45 44.22,233.06 44.22,204.24 44.7,203.76 44.7,202.95 49.02,198.63 v52.58,198.63 | 16.76,231.65 16.89,231.77 J4.GND(3) 18.09,233.68 21.08,233.68
  Bottom 0.406: 22.99,228.4 22.86,228.27
  other vias: 14.99,243.26 17.53,219.89 141.48,241.81 144.27,250.95 122.17,242.82 122.94,242.82 122.17,242.06 122.94,242.06 121.41,242.82 121.41,242.06 122.94,247.65 122.94,248.41 122.17,247.65 121.41,247.65 122.17,248.41 121.41,248.41 126.75,244.86 125.48,250.95 126.75,245.87 23.37,243.26 125.98,238.25 31.5,242.49 23.11,233.1 39.88,243.26 14.73,227.25 151.38,245.87 152.15,245.87 152.15,246.63 151.38,246.63 152.91,245.87 152.91,246.63 34.8,222.17 10.16,235.38 141.48,239.52 26.16,233.86 16.51,239.45 8.13,234.37 164.85,244.35 164.85,243.08 164.85,241.81 164.85,240.54 164.85,239.27 164.85,238 163.58,238 163.58,239.27 163.58,240.54 163.58,241.81 163.58,243.08 163.58,244.35 185.17,244.35 185.17,243.08 185.17,241.81 185.17,240.54 185.17,239.27 185.17,238 186.44,238 186.44,239.27 186.44,240.54 186.44,241.81 186.44,243.08 186.44,244.35 130.05,244.35 172.21,216.97 161.04,217.22 54.48,224.28 54.48,224.79 54.48,225.3 54.99,225.3 54.99,224.79 54.99,224.28 55.5,224.28 55.5,224.79 55.5,225.3 52.58,227.2 53.21,227.2 53.85,227.2 53.85,222.12 53.21,222.12 52.58,222.12 54.17,221.49 53.53,221.49 52.9,221.49 52.26,221.49 46.86,227.2 46.23,227.2 45.91,227.84 45.91,228.6 45.91,229.43 46.23,230.06 46.86,230.06 73.53,224.28 73.53,224.79 73.53,225.3 74.04,225.3 74.04,224.79 74.04,224.28 74.55,224.28 74.55,224.79 74.55,225.3 71.63,227.2 72.26,227.2 72.9,227.2 72.9,222.12 72.26,222.12 71.63,222.12 73.22,221.49 72.58,221.49 71.95,221.49 71.31,221.49 65.91,227.2 65.28,227.2 64.96,227.84 64.96,228.6 64.96,229.43 65.28,230.06 65.91,230.06 92.58,224.28 92.58,224.79 92.58,225.3 93.09,225.3 93.09,224.79 93.09,224.28 93.6,224.28 93.6,224.79 93.6,225.3 90.68,227.2 91.31,227.2 91.95,227.2 91.95,222.12 91.31,222.12 90.68,222.12 92.27,221.49 91.63,221.49 91,221.49 90.36,221.49 84.96,227.2 84.33,227.2 84.01,227.84 84.01,228.6 84.01,229.43 84.33,230.06 84.96,230.06 111.63,224.28 111.63,224.79 111.63,225.3 112.14,225.3 112.14,224.79 112.14,224.28 112.65,224.28 112.65,224.79 112.65,225.3 109.73,227.2 110.36,227.2 111,227.2 111,222.12 110.36,222.12 109.73,222.12 111.32,221.49 110.68,221.49 110.05,221.49 109.41,221.49 104.01,227.2 103.38,227.2 103.06,227.84 103.06,228.6 103.06,229.43 103.38,230.06 104.01,230.06 130.68,224.28 130.68,224.79 130.68,225.3 131.19,225.3 131.19,224.79 131.19,224.28 131.7,224.28 131.7,224.79 131.7,225.3 128.78,227.2 129.41,227.2 130.05,227.2 130.05,222.12 129.41,222.12 128.78,222.12 130.37,221.49 129.73,221.49 129.1,221.49 128.46,221.49 123.06,227.2 122.43,227.2 122.11,227.84 122.11,228.6 122.11,229.43 122.43,230.06 123.06,230.06 149.73,224.28 149.73,224.79 149.73,225.3 150.24,225.3 150.24,224.79 150.24,224.28 150.75,224.28 150.75,224.79 150.75,225.3 147.83,227.2 148.46,227.2 149.1,227.2 149.1,222.12 148.46,222.12 147.83,222.12 149.42,221.49 148.78,221.49 148.15,221.49 147.51,221.49 142.11,227.2 141.48,227.2 141.16,227.84 141.16,228.6 141.16,229.43 141.48,230.06 142.11,230.06 71.37,199.39 80.52,197.61 90.93,199.64 97.28,197.87 109.73,200.15 116.84,197.87 128.02,199.9 137.67,197.36 147.32,196.6 157.99,199.9 66.8,197.36 131.57,192.28 46.23,191.01 52.83,190.25 158.5,239.52 163.58,250.19 179.58,252.22 190.25,215.39 168.4,209.8 180.34,201.17 103.38,192.28 122.68,192.53 5.08,195.58 20.83,199.39 34.8,213.61 3.56,222 22.1,251.21 74.17,190.5 140.72,192.53 161.54,192.79 175.51,191.26 89.41,191.01 95.25,189.99
  pour Top (isolate 0.406, rank 3): 119.13,237.49 131.83,237.49 131.83,252.73 119.13,252.73
  pour Top (isolate 0.305): 4.83,251.46 4.83,215.9 41.66,215.9 41.66,251.46
  pour Bottom (isolate 0.406): 4.83,215.9 41.66,215.9 41.66,251.46 4.83,251.46
  pour Bottom (isolate 0.406): 119.13,237.49 119.13,252.73 131.83,252.73 131.83,237.49
  pour Top (isolate 0.305, rank 2): 160.27,215.14 160.27,250.7 189.48,250.7 189.48,215.14
  pour Bottom (isolate 0.406, rank 2): 160.27,250.7 189.48,250.7 189.48,215.14 160.27,215.14
  pour Top (isolate 0.305, rank 4): 0.76,255.52 194.56,255.52 194.56,0 0.76,0
  pour Bottom (isolate 0.381, rank 4): 1.02,254.51 195.33,254.51 195.33,0 1.02,0
LED+  (via drill 0.35)
  Top 0.305: C31.2 61.83,226.27 TP19.TP | v97.54,190.5 96.06,191.98 arc45 95.34,192.28 60.11,192.28 arc-45 59.39,192.58 v58.55,193.42
  Top 0.559: 61.83,226.27 63.25,224.85 63.25,207.37 arc-45 62.95,206.65 LED+1.MP
  Top 0.61: RS1.1 54.65,227.73 U$11.4 56.48,226.44 C31.2
  Top 0.813: 62.99,226.38 61.72,227.65
  Bottom 0.305: v97.54,190.5 97.95,190.09 arc45 98.67,189.79 172.2,189.79 arc-45 172.92,189.49 185.33,177.08 arc-45 185.62,176.36 185.62,98.46 arc-45 185.33,97.75 184.52,96.94 arc-45 183.81,96.65 169.44,96.65 arc45 168.72,96.35 167.94,95.57 arc45 167.64,94.85 CH1-6.A@1
  Bottom 0.61: LED+1.MP v58.55,193.42
  pour Top (isolate 0.305, rank 2): 54.42,226.06 54.42,227.96 53.47,227.96 53.47,231.46 62.99,231.46 62.99,225.11 57.91,225.11 57.28,225.74 56.32,225.74 56.32,226.06
LED+_2  (via drill 0.35)
  Top 0.305: C45.2 80.87,226.27 81.19,225.96 TP24.TP | v93.22,188.21 v93.22,189.99
  Top 0.559: 81.19,225.96 82.3,224.85 82.3,207.37 arc-45 82,206.65 LED+3.MP
  Top 0.61: RS3.1 73.7,227.73 U$12.4 75.53,226.44 C45.2
  Top 0.813: 82.04,226.38 80.77,227.65
  Bottom 0.305: v93.22,189.99 93.06,189.83 arc-45 92.34,189.53 90.17,189.53 arc45 89.74,189.35 arc-45 89.25,189.15 82.28,189.15 arc-45 81.57,189.45 77.9,193.12 arc-45 77.6,193.84 77.6,194.31 | CH2-1.A@1 139.7,149.95 arc-45 140,150.67 140.42,151.09 arc-45 141.14,151.38 153,151.38 arc45 153.71,151.68 153.92,151.89 arc45 154.08,152.26 154.08,176.97 arc45 153.78,177.69 153.76,177.71 arc45 153.05,178 141.47,178 arc-45 140.75,178.3 139.67,179.38 arc45 138.95,179.68 128.34,179.68 arc-45 127.62,179.98 127.25,180.35 arc45 126.53,180.64 117.59,180.64 arc-45 117.09,180.85 arc-45 116.84,181.46 116.84,186.4 arc45 116.54,187.11 115.94,187.71 arc45 115.22,188.01 93.71,188.01 arc-45 v93.22,188.21
  Bottom 0.61: 77.6,194.31 LED+3.MP
  pour Top (isolate 0.305, rank 2): 73.47,226.06 73.47,227.96 72.52,227.96 72.52,231.46 82.04,231.46 82.04,225.11 76.96,225.11 76.33,225.74 75.37,225.74 75.37,226.06
LED+_3
  Top 0.305: C51.2 99.92,226.27 TP39.TP
  Top 0.559: 101.09,226.38 101.29,226.18 101.29,207.31 arc-45 100.99,206.59 LED+5.MP
  Top 0.61: RS5.1 92.75,227.73 U$14.4 94.58,226.44 C51.2
  Bottom 0.305: 96.42,193.14 96.42,190.77 arc45 96.72,190.05 97.24,189.53 arc45 97.96,189.23 171.79,189.23 arc-45 172.51,188.93 184.69,176.75 arc-45 184.99,176.03 184.99,124.45 arc-45 184.69,123.73 183.69,122.73 arc-45 182.97,122.43 169.33,122.43 arc45 168.61,122.13 167.94,121.46 arc45 167.64,120.74 CH3-5.A
  Bottom 0.61: LED+5.MP 96.65,198.45 96.42,198.22 96.42,193.14
  pour Top (isolate 0.305, rank 2): 92.52,226.06 92.52,227.96 91.57,227.96 91.57,231.46 101.09,231.46 101.09,225.11 96.01,225.11 95.38,225.74 94.42,225.74 94.42,226.06
LED+_4  (via drill 0.35)
  Top 0.305: C48.2 118.97,226.27 TP29.TP 119.94,226.18 120.34,226.18 | v115.7,193.04 v115.7,186.69
  Top 0.559: LED+4.MP 120.04,206.59 arc45 120.34,207.31 120.34,226.18
  Top 0.61: RS4.1 111.8,227.73 U$13.4 113.63,226.44 C48.2
  Bottom 0.305: LED+4.MP v115.7,193.04 | v115.7,186.69 115.7,181.78 arc45 116,181.06 116.67,180.38 arc45 117.39,180.09 126.12,180.09 arc-45 126.84,179.79 127.21,179.42 arc45 127.93,179.12 138.52,179.12 arc-45 139.24,178.82 139.4,178.66 arc-45 139.7,177.94 CH4-1.A@1
  pour Top (isolate 0.305, rank 2): 111.57,226.06 111.57,227.96 110.62,227.96 110.62,231.46 120.14,231.46 120.14,225.11 115.06,225.11 114.43,225.74 113.47,225.74 113.47,226.06
LED+_5  (via drill 0.35)
  Top 0.305: C54.2 138.02,226.27 TP73.TP | v156.72,151.89 155.45,153.16 v154.94,153.16 | v134.62,193.04 v134.62,187.2
  Top 0.559: 139.19,226.38 139.39,226.18 139.39,207.31 arc-45 139.09,206.59 LED+6.MP
  Top 0.61: RS6.1 130.85,227.73 U$15.4 132.68,226.44 C54.2
  Bottom 0.305: v134.62,193.04 134.62,202.12 | v134.62,187.2 134.62,181.42 arc45 134.86,180.83 135.12,180.58 arc45 135.76,180.31 139.33,180.31 arc-45 140.05,180.02 141.21,178.86 arc45 141.93,178.56 153.5,178.56 arc-45 154.22,178.26 154.64,177.84 arc-45 154.94,177.12 v154.94,153.16 | v156.72,151.89 156.93,152.1 arc-45 157.65,152.4 165.95,152.4 arc-45 166.67,152.1 167.34,151.43 arc-45 167.64,150.71 CH5-6.A
  Bottom 0.61: 134.62,202.12 LED+6.MP
  pour Top (isolate 0.305, rank 2): 130.62,226.06 130.62,227.96 129.67,227.96 129.67,231.46 139.19,231.46 139.19,225.11 134.11,225.11 133.48,225.74 132.52,225.74 132.52,226.06
LED+_6  (via drill 0.35)
  Top 0.305: C60.2 157.07,226.27 TP83.TP | v167.64,187.58 v167.64,193.04
  Top 0.559: LED+8.MP 159.26,202.37 159.26,225.04 157.26,227.04
  Top 0.61: RS8.1 149.9,227.73 U$17.4 151.73,226.44 C60.2
  Bottom 0.305: v167.64,187.58 CH4-8.A@1 | v167.64,193.04 167.64,193.32 arc45 167.34,194.04 LED+8.MP
  pour Top (isolate 0.305, rank 2): 149.67,226.06 149.67,227.96 148.72,227.96 148.72,231.46 158.24,231.46 158.24,225.11 153.16,225.11 152.53,225.74 151.57,225.74 151.57,226.06
LED-  (via drill 0.35)
  Top 0.305: L9.2 58.41,214.63 TP10.TP | v53.85,193.04 v46.23,185.42 | v41.15,177.04 42.93,178.82 v43.18,178.82
  Top 0.559: LED-1.MP 55.47,203.87 | 56.13,205.49 56.13,206.25
  Top 0.61: 55.47,203.87 55.84,204.24 arc45 56.13,204.95 56.13,205.49
  Bottom 0.305: v41.15,177.04 41.15,176.99 41.35,176.78 41.35,154.09 arc-45 41.05,153.37 40.63,152.95 arc-45 39.91,152.65 28.49,152.65 arc45 27.77,152.36 27.48,152.06 arc-45 26.76,151.76 15.03,151.76 arc45 14.31,151.47 13.76,150.92 arc45 13.46,150.2 13.46,125.39 arc45 13.76,124.67 14.22,124.21 arc45 14.71,124 26.55,124 arc45 27.27,124.3 27.64,124.67 arc45 27.94,125.39 CH1-5.C@1 | v46.23,185.42 45.51,184.7 arc45 45.21,183.98 45.21,181.27 arc-45 44.91,180.55 v43.18,178.82
  Bottom 0.61: LED-1.MP v53.85,193.04
  pour Top (isolate 0.305): 56.32,225.11 56.32,221.93 55.69,221.93 55.69,206.06 62.99,206.06 62.99,224.47 57.91,224.47 57.28,225.11
LED-_2  (via drill 0.35)
  Top 0.305: L10.2 77.46,214.63 TP21.TP | v98.81,190.75 98.79,190.75 97.01,192.54 arc45 96.29,192.84 73.52,192.84 arc-45 72.8,193.13 v72.64,193.29
  Top 0.508: LED-3.MP 77.22,206.82 77.22,207.01
  Bottom 0.305: 114.07,191.24 114.2,191.11 172.81,191.11 arc-45 173.53,190.81 186.49,177.85 arc-45 186.74,177.24 186.74,71.31 arc-45 186.44,70.59 185.8,69.94 arc-45 185.08,69.65 156.43,69.65 arc45 155.71,69.35 155.29,68.93 arc45 154.99,68.21 154.99,42.2 arc45 155.28,41.49 arc45 155.99,41.2 166.51,41.2 arc45 167.23,41.5 167.39,41.66 arc45 167.64,42.27 CH2-6.C@1 | 114.07,191.24 114.05,191.26 | 114.07,191.24 114.06,191.24 113.83,191.46 113.14,191.46 arc45 112.43,191.16 112.31,191.05 arc-45 111.59,190.75 v98.81,190.75
  Bottom 0.61: LED-3.MP v72.64,193.29
  pour Top (isolate 0.305): 75.37,225.11 75.37,221.93 74.74,221.93 74.74,206.06 82.04,206.06 82.04,224.47 76.96,224.47 76.33,225.11
LED-_3  (via drill 0.35)
  Top 0.305: L12.2 96.51,214.63 TP31.TP | v90.68,188.21 90.68,188.81 arc-45 91.34,190.39 v91.44,190.5
  Top 0.559: LED-5.MP 90.74,202.25 95,206.5
  Bottom 0.305: v90.68,188.21 arc-45 90.06,187.96 16.93,187.96 arc45 16.21,187.66 12.24,183.69 arc45 11.94,182.97 11.94,42.51 arc45 12.2,41.88 arc45 12.92,41.58 26.3,41.58 arc45 27.02,41.88 27.64,42.5 arc45 27.94,43.22 CH3-6.C@1 | v91.44,190.5 91.65,190.71 arc45 91.95,191.43 91.95,193.55
  Bottom 0.61: 91.95,193.55 LED-5.MP
  pour Top (isolate 0.305): 94.42,225.11 94.42,221.93 93.79,221.93 93.79,206.06 101.09,206.06 101.09,224.47 96.01,224.47 95.38,225.11
LED-_4  (via drill 0.35)
  Top 0.305: L11.2 115.56,214.63 TP26.TP | v111,193.04 v113.28,190.75
  Top 0.508: LED-4.MP 115.32,206.82 115.32,207.01
  Bottom 0.305: v113.28,190.75 113.61,190.42 172.55,190.42 arc-45 173.27,190.13 185.89,177.51 arc-45 186.18,176.8 186.18,71.79 arc-45 185.88,71.08 185.34,70.53 arc-45 184.62,70.23 156.12,70.23 arc45 155.4,69.93 154.73,69.26 arc45 154.43,68.54 154.43,16.58 arc45 154.73,15.86 156.51,14.08 arc-45 156.81,13.36 156.81,11.25 arc45 157.1,10.54 157.44,10.2 arc45 158.16,9.91 166.2,9.91 arc45 166.92,10.2 167.34,10.62 arc45 167.64,11.34 CH4-6.C@1
  Bottom 0.61: v111,193.04 LED-4.MP
  pour Top (isolate 0.305): 113.47,225.11 113.47,221.93 112.84,221.93 112.84,206.06 120.14,206.06 120.14,224.47 115.06,224.47 114.43,225.11
LED-_5  (via drill 0.35)
  Top 0.305: L13.2 134.61,214.63 TP63.TP | v129.29,193.04 125.22,188.98 v125.22,188.47
  Top 0.559: LED-6.MP 128.84,202.25 133.1,206.5
  Bottom 0.305: v125.22,188.47 125.12,188.57 94.4,188.57 arc-45 93.68,188.87 arc45 93.42,188.98 90.64,188.98 arc45 90.29,188.83 arc-45 89.66,188.57 16.52,188.57 arc45 15.81,188.27 11.47,183.94 arc45 11.18,183.22 11.18,14.52 arc45 11.47,13.8 14.92,10.35 arc45 15.57,10.08 26.38,10.08 arc45 27.09,10.38 27.64,10.93 arc45 27.94,11.65 CH5-5.C@1
  Bottom 0.508: v129.29,193.04 129.29,193.55
  Bottom 0.61: 129.29,193.55 LED-6.MP
  pour Top (isolate 0.305): 132.52,225.11 132.52,221.93 131.89,221.93 131.89,206.06 139.19,206.06 139.19,224.47 134.11,224.47 133.48,225.11
LED-_6  (via drill 0.35)
  Top 0.305: L15.2 153.66,214.63 TP80.TP | v114.55,186.69 114.69,186.69 115.26,186.13 arc45 115.61,185.98 115.82,185.98 arc45 116.35,186.2 v117.6,187.45 | v153.67,193.04 v149.1,188.47
  Top 0.559: 157.99,206.25 153.99,202.25 LED-8.MP
  Bottom 0.305: v114.55,186.69 114.05,187.2 arc45 113.74,187.32 17.31,187.32 arc45 16.59,187.03 13,183.43 arc45 12.7,182.71 12.7,69.7 arc45 12.95,69.09 13.16,68.88 arc45 13.88,68.58 26.5,68.58 arc45 27.22,68.88 27.64,69.3 arc45 27.94,70.02 CH4-7.C@1 | 149.01,188.56 v149.1,188.47 148.9,188.67 127.29,188.67 arc45 126.7,188.43 126.34,188.06 arc-45 125.62,187.76 118.33,187.76 arc45 117.61,187.46 v117.6,187.45 | v153.67,193.04 LED-8.MP
  pour Top (isolate 0.305): 151.57,225.11 151.57,221.93 150.94,221.93 150.94,206.06 158.24,206.06 158.24,224.47 153.16,224.47 152.53,225.11
LX
  pour Top (isolate 0.305, no thermals): 51.88,223.84 51.88,222.57 51.24,221.93 51.24,207.96 46.48,207.96 46.48,223.52 46.8,223.84
LX_2
  pour Top (isolate 0.305, no thermals): 70.93,223.84 70.93,222.57 70.29,221.93 70.29,207.96 65.53,207.96 65.53,223.52 65.85,223.84
LX_3
  pour Top (isolate 0.305, no thermals): 89.98,223.84 89.98,222.57 89.34,221.93 89.34,207.96 84.58,207.96 84.58,223.52 84.9,223.84
LX_4
  pour Top (isolate 0.305, no thermals): 109.03,223.84 109.03,222.57 108.39,221.93 108.39,207.96 103.63,207.96 103.63,223.52 103.95,223.84
LX_5
  pour Top (isolate 0.305, no thermals): 128.08,223.84 128.08,222.57 127.44,221.93 127.44,207.96 122.68,207.96 122.68,223.52 123,223.84
LX_6
  pour Top (isolate 0.305, no thermals): 147.13,223.84 147.13,222.57 146.49,221.93 146.49,207.96 141.73,207.96 141.73,223.52 142.05,223.84
N$1
  Top 0.559: R39.1 143.03,241.57 D1.A
N$2
  Bottom 0.305: CH2-5.A 27.94,184.24 arc-45 28.24,184.96 28.4,185.12 arc-45 29.12,185.42 36.92,185.42 arc-45 37.64,185.12 37.8,184.96 arc-45 38.1,184.24 38.1,181.78 arc45 38.4,181.06 41.61,177.84 arc-45 41.91,177.12 41.91,69.51 arc45 42.21,68.79 42.25,68.75 arc45 42.97,68.45 54.32,68.45 arc45 55.03,68.75 55.58,69.3 arc45 55.88,70.02 CH2-4.C@1
N$3
  Top 0.305: R41.1 122.67,240.3 arc-45 122.96,241.02 124.49,242.54 arc45 124.74,243.15 124.74,248.23 arc45 124.44,248.95 D6.A
N$4
  Top 0.559: D4.A 163.35,217.66 R11.1
N$5
  Top 0.508: Q1.B 45.68,244.37 RB.1
N$6
  Top 0.508: RC1.1 R4.1 45.94,247.26 Q1.C
N$7
  Top 0.508: Q1.E 50.06,244.52 Q2.E 50.26,244.71 R5.1
N$8
  Top 0.61: R2.2 47.72,199.52 arc-45 48.43,199.81 Q3.B
N$9
  Top 0.508: Q2.B 50.51,246.87 R10.1 R4.2
N$10
  Top 0.559: 67.56,199.81 Q4.B
  Top 0.61: R12.2 66.13,199.52 arc-45 66.85,199.81 67.56,199.81
N$11  (via drill 0.35)
  Top 0.305: R2.1 44.23,196.05 v44.2,196.09 | v42.67,220.98 v42.67,223.77
  Top 0.508: Q2.C 55.63,245.87 v55.63,250.95 RC2.2
  Top 0.559: R2.1 R12.1 R16.1 R18.1 R20.1 R22.1
  Bottom 0.305: 43.59,227.3 43.56,227.33 | v42.67,220.98 42.67,220.88 43.38,220.17 arc-45 43.59,219.68 43.59,197.12 arc45 43.88,196.4 v44.2,196.09 | 43.59,227.3 43.59,225.04 arc-45 43.34,224.44 v42.67,223.77 | 43.59,227.3 43.59,238.49 arc-45 43.88,239.21 v55.63,250.95
N$12
  Top 0.61: R16.2 85.31,199.52 arc-45 86.03,199.81 Q5.B
N$22
  Top 0.61: R18.2 104.23,199.52 arc-45 104.95,199.81 Q6.B
N$23
  Top 0.61: R20.2 122.26,199.52 arc-45 122.98,199.81 Q7.B
N$24
  Top 0.61: R22.2 142.08,199.52 arc-45 142.79,199.81 Q8.B
N$25
  Top 0.305: RB2.2 47.24,240.25 | NTC-1.MP 55.91,239.8 51.25,239.8 RB1.1
  Top 0.508: RB.2 RB2.2 RB1.1
  Top 1.524: NTC-.MP NTC-1.MP
N$26  (via drill 0.35)
  Top 0.305: v70.36,96.82 v65.41,96.82
  Bottom 0.305: v65.41,96.82 57.62,96.82 arc45 56.9,96.53 56.18,95.8 arc45 55.88,95.08 CH2-4.A | v70.36,96.82 82.38,96.82 arc45 83.1,97.12 83.52,97.54 arc45 83.82,98.26 CH2-3.C
N$30  (via drill 0.35)
  Top 0.305: v97.41,39.42 v97.41,41.71 | v97.16,123.49 v93.98,123.49
  Bottom 0.305: v97.41,41.71 97.51,41.81 97.51,122.72 arc45 97.21,123.44 v97.16,123.49 | CH2-3.A@1 83.82,121.93 arc-45 84.12,122.65 84.66,123.2 arc-45 85.38,123.49 v93.98,123.49 | CH2-2.C 111.76,10.59 arc-45 111.63,10.29 111.47,10.13 arc-45 110.75,9.83 102.05,9.83 arc-45 101.5,10.06 101.39,10.17 arc-45 101.09,10.89 101.09,12.79 arc45 100.79,13.51 97.71,16.59 arc-45 97.41,17.31 v97.41,39.42
N$31  (via drill 0.35)
  Top 0.305: v9.65,151.64 10.12,152.1 arc-45 10.84,152.4 v13.72,152.4
  Bottom 0.305: CH2-5.C@1 27.94,153.84 arc-45 27.64,153.12 27.22,152.7 arc-45 26.5,152.4 v13.72,152.4 | CH2-6.A 167.64,67.65 arc-45 167.94,68.37 168.36,68.79 arc-45 169.08,69.09 184.49,69.09 arc-45 185.21,68.79 185.88,68.12 arc-45 186.18,67.4 186.18,11.6 arc-45 185.88,10.88 183.18,8.17 arc-45 182.46,7.87 48.94,7.87 arc45 48.22,7.58 47.68,7.04 arc-45 47.24,6.86 41.51,6.86 arc-45 40.89,7.11 40.43,7.58 arc45 39.71,7.87 14.39,7.87 arc-45 13.67,8.17 9.19,12.66 arc-45 8.89,13.38 8.89,97.18 arc-45 9.14,97.79 9.35,98 arc45 9.65,98.72 v9.65,151.64
N$32  (via drill 0.35)
  Top 0.305: v42.42,41.15 v39.62,43.94
  Bottom 0.305: v39.62,43.94 39.9,44.22 39.9,91.99 arc45 39.61,92.7 39.57,92.73 arc-45 39.37,93.22 arc-45 39.55,93.66 40.29,94.39 arc45 40.59,95.11 40.59,121.8 arc45 40.29,122.52 39.92,122.89 arc45 39.2,123.19 29.31,123.19 arc45 28.7,122.94 28.24,122.47 arc45 27.94,121.75 CH4-5.A | CH4-4.C@1 55.88,42.58 arc-45 55.58,41.87 55.16,41.45 arc-45 54.44,41.15 v42.42,41.15
N$33  (via drill 0.35)
  Top 0.305: v9.65,97.28 9.86,97.49 arc-45 10.58,97.79 v13.97,97.79
  Bottom 0.305: v13.97,97.79 14.02,97.84 26.3,97.84 arc45 27.02,98.14 27.64,98.76 arc45 27.94,99.48 CH4-5.C@1 | v9.65,97.28 9.65,13.63 arc45 9.95,12.91 13.97,8.89 arc45 14.58,8.64 40.02,8.64 arc-45 40.73,8.34 41.23,7.84 arc45 41.95,7.54 46.75,7.54 arc45 47.47,7.84 47.96,8.34 arc-45 48.68,8.64 182.21,8.64 arc45 182.92,8.93 185.12,11.13 arc45 185.42,11.85 185.42,38.19 arc45 185.12,38.91 183.94,40.09 arc45 183.22,40.39 169.08,40.39 arc45 168.36,40.09 167.94,39.67 arc45 167.64,38.95 CH4-6.A@1
N$34  (via drill 0.35)
  Top 0.305: v39.37,97.54 39.37,95.91 arc-45 39.07,95.19 38.66,94.78 38.66,94.19 39.42,93.43 39.42,92.92 39.84,92.51 40.78,92.51 arc45 41.5,92.81 v43.18,94.49
  Bottom 0.305: v43.18,94.49 42.77,94.9 arc-45 42.47,95.62 42.47,151.27 arc-45 42.77,151.99 42.93,152.15 arc-45 43.54,152.4 54.5,152.4 arc45 55.12,152.65 55.58,153.12 arc45 55.88,153.84 CH6-4.C@1 | v39.37,97.54 29.38,97.54 arc45 28.66,97.24 28.24,96.82 arc45 27.94,96.1 CH4-7.A@1
N$35  (via drill 0.35)
  Top 0.305: v155.45,98.3 v153.42,96.27
  Bottom 0.305: v155.45,98.3 155.19,98.55 155.19,151.25 arc-45 155.49,151.96 156.19,152.66 arc-45 156.91,152.96 165.95,152.96 arc45 166.67,153.26 167.34,153.93 arc45 167.64,154.65 CH4-8.C | v153.42,96.27 arc45 153.16,95.65 153.16,69.95 arc-45 152.91,69.34 152.7,69.13 arc-45 151.98,68.83 141.14,68.83 arc45 140.42,68.54 140,68.12 arc45 139.7,67.4 CH6-1.A@1
N$36
  Bottom 0.305: CH1-5.A@1 27.94,151.15 arc-45 28.16,151.68 arc-45 28.86,151.97 39.89,151.97 arc-45 40.61,151.67 40.89,151.38 arc-45 41.15,150.77 41.15,16.93 arc45 41.45,16.21 42.12,15.54 arc45 42.84,15.24 54.19,15.24 arc45 54.91,15.54 55.58,16.21 arc45 55.88,16.93 CH1-4.C@1
N$37  (via drill 0.35)
  Top 0.305: v67.31,149.86 v69.34,151.89
  Bottom 0.305: v67.31,149.86 67.51,149.66 67.51,52.02 67.51,42.29 arc-45 67.21,41.57 67.14,41.5 arc-45 66.42,41.2 57.62,41.2 arc45 56.91,40.9 56.18,40.18 arc45 55.88,39.46 CH1-4.A | v69.34,151.89 69.55,152.1 arc-45 70.27,152.4 82.13,152.4 arc45 82.85,152.7 83.52,153.37 arc45 83.82,154.09 CH1-3.C@1
N$38  (via drill 0.35)
  Top 0.305: v127.2,122.22 v124.59,122.22
  Bottom 0.305: v124.59,122.22 124.79,122.02 124.79,41.38 arc-45 124.62,40.98 arc-45 123.92,40.69 112.99,40.69 arc45 112.28,40.39 112.06,40.18 arc45 111.76,39.46 CH2-2.A@1 | CH2-1.C@1 139.7,123.86 arc-45 139.4,123.15 138.78,122.52 arc-45 138.06,122.22 v127.2,122.22
N$39  (via drill 0.35)
  Top 0.305: v70.23,122.48 v66.67,122.48
  Bottom 0.305: v66.67,122.48 66.8,122.48 66.8,69.7 arc-45 66.55,69.09 66.34,68.88 arc-45 65.62,68.58 57.32,68.58 arc45 56.6,68.28 56.18,67.86 arc45 55.88,67.14 CH4-4.A@1 | CH4-3.C 83.82,124.88 arc-45 83.52,124.16 83.15,123.79 arc-45 82.43,123.49 71.67,123.49 arc45 70.95,123.2 v70.23,122.48
N$40  (via drill 0.35)
  Top 0.305: v95.48,152.73 97.38,152.73 v97.41,152.7 | v98.68,125.78 v98.68,124
  Bottom 0.305: v95.48,152.73 95.46,152.7 85.38,152.7 arc45 84.66,152.41 84.12,151.86 arc45 83.82,151.14 CH4-3.A | v98.68,125.78 98.68,125.98 97.71,126.96 arc-45 97.41,127.67 v97.41,152.7 | v98.68,124 98.47,123.79 arc45 98.17,123.07 98.17,88.21 98.12,88.16 98.12,73.82 arc45 98.42,73.1 98.82,72.69 98.89,72.69 arc-45 99.61,72.4 100.84,71.16 arc45 101.56,70.87 110.58,70.87 arc45 111.3,71.16 111.46,71.33 arc45 111.76,72.05 CH4-2.C@1
N$41  (via drill 0.35)
  Top 0.305: v127.89,151.44 v124.08,151.44